# Altium schematic sheet ARE134H.SchDoc
size A4
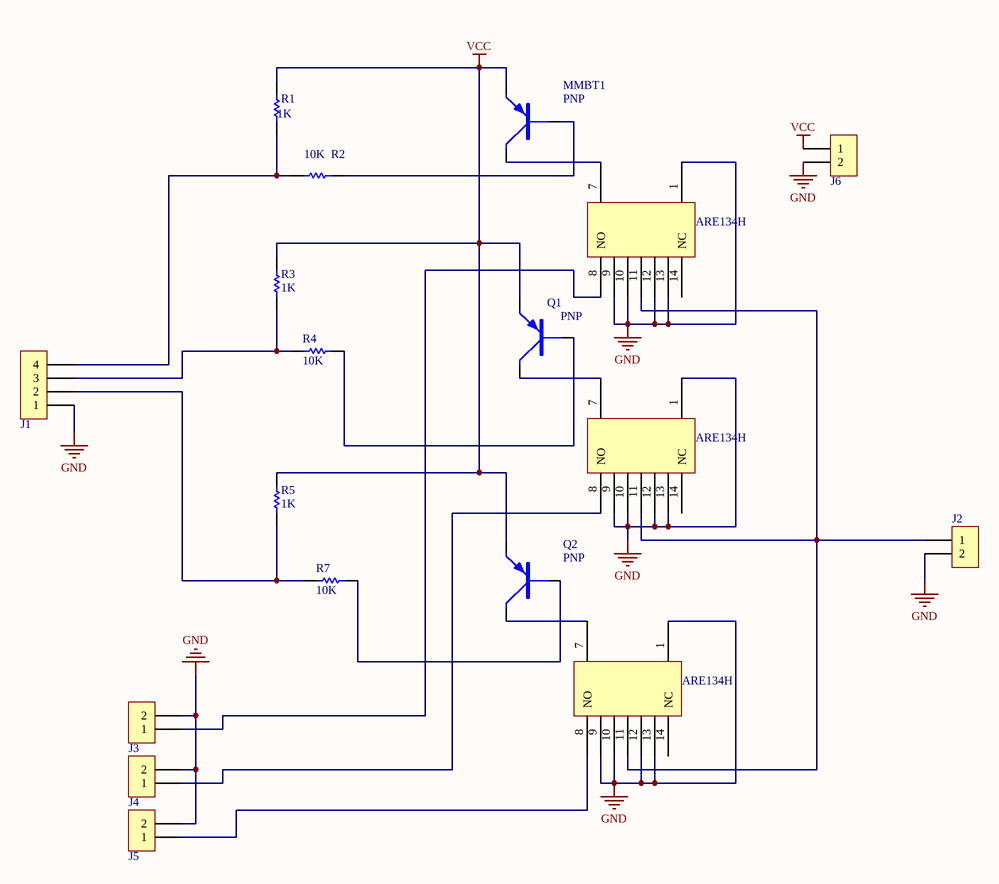
[diagram p0: ARE134H.SchDoc]

## Parts
1  ARE134H  [DIP14]
2  ARE134H  [DIP14]
3  ARE134H  [DIP14]
J1  Pin HDR1X4  [Pin HDR1X4/2.54mm-S]  (value not drawn)
J2  Pin HDR1X2  [Pin HDR1X2/2.54mm-S]  (value not drawn)
J3  Pin HDR1X2  [Pin HDR1X2/2.54mm-S]  (value not drawn)
J4  Pin HDR1X2  [Pin HDR1X2/2.54mm-S]  (value not drawn)
J5  Pin HDR1X2  [Pin HDR1X2/2.54mm-S]  (value not drawn)
J6  Pin HDR1X2  [Pin HDR1X2/2.54mm-S]  (value not drawn)
MMBT1  PNP  [SOT-23]
Q1  PNP  [SOT-23]
Q2  PNP  [SOT-23]
R1  value 1K  [0805R]  (hidden comment: RES)
R2  value 10K  [0805R]  (hidden comment: RES)
R3  value 1K  [0805R]  (hidden comment: RES)
R4  value 10K  [0805R]  (hidden comment: RES)
R5  value 1K  [0805R]  (hidden comment: RES)
R7  value 10K  [0805R]  (hidden comment: RES)

## Nets
GND: 1.1 1.9 1.10 1.12 1.13 2.1 2.9 2.10 2.12 2.13 3.1 3.9 3.10 3.12 3.13 J1.1 J2.2 J3.2 J4.2 J5.2 J6.2
VCC: J6.1 MMBT1.E Q1.E Q2.E R1.2 R3.2 R5.2
Net1_7: 1.7 MMBT1.C
Net1_8: 1.8(NO) J3.1
Net1_11: 1.11 2.11 3.11 J2.1
Net2_7: 2.7 Q1.C
Net2_8: 2.8(NO) J4.1
Net3_7: 3.7 Q2.C
Net3_8: 3.8(NO) J5.1
NetJ1_2: J1.2 R5.1 R7.1
NetJ1_3: J1.3 R3.1 R4.1
NetJ1_4: J1.4 R1.1 R2.1
NetMMBT1_B: MMBT1.B R2.2
NetQ1_B: Q1.B R4.2
NetQ2_B: Q2.B R7.2

Not connected (* = marked no-connect by the designer): 1 14(NC); 2 14(NC); 3 14(NC)

## Library data of the parts
1-3 = Component_1
MMBT1 Q1 Q2 = PNP: PNP三极管